# EAGLE design BSAT - Control Shield (EAGLE 6.5.0)
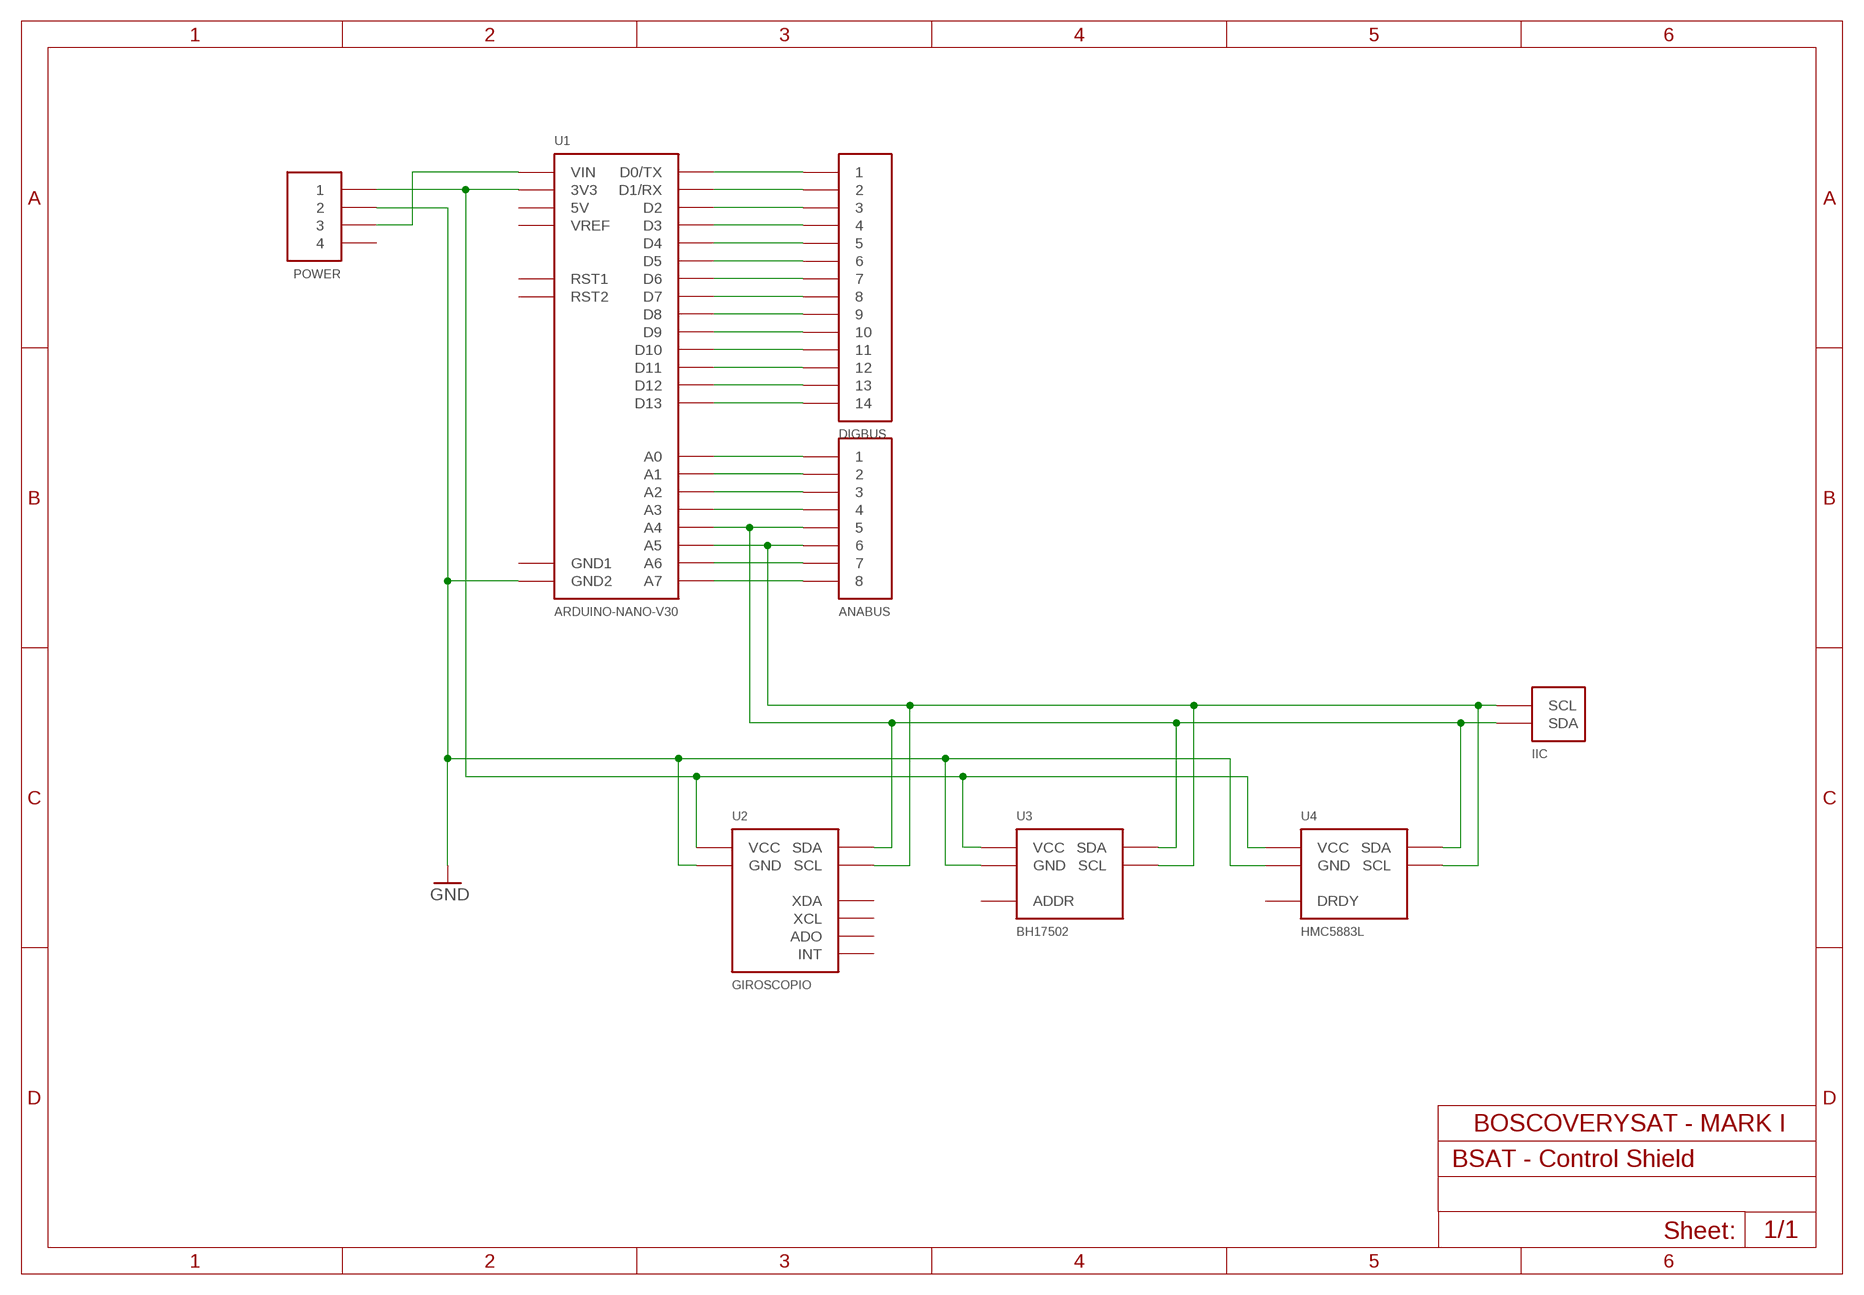
[diagram p0: schematic, sheet 1]

## Parts
ANABUS  8-PIN-DUAL-BUS  [8-PIN-DUAL-BUS]
DIGBUS  14-PIN-DUAL-BUS  [14-PIN-DUAL-BUS]
IIC  IIC-DUAL-BUS  [2-PIN-DUAL-BUS]
POWER  4-PIN-DUAL-BUS  [4-PIN-LINEAL-JUMPER]
U1  ARDUINO-NANO-V30  [ARDUINO-NANO-V30]
U2  GIROSCOPIO  [GIROSCOPIO]
U3  BH17502  [BH1750-2]
U4  HMC5883L  [HMC5883L]

## Nets
GND: POWER.2A POWER.2B U1.GND2 U2.GND U3.GND U4.GND
N$5: DIGBUS.1A DIGBUS.1B U1.D0/TX
N$6: DIGBUS.2A DIGBUS.2B U1.D1/RX
N$7: POWER.3A POWER.3B U1.VIN
N$9: POWER.1A POWER.1B U1.3V3 U2.VCC U3.VCC U4.VCC
N$16: ANABUS.8A ANABUS.8B U1.A7
N$17: ANABUS.7A ANABUS.7B U1.A6
N$28: ANABUS.6A ANABUS.6B IIC.2A(SCL) IIC.2B(SCL) U1.A5 U2.SCL U3.SCL U4.SCL
N$29: ANABUS.5A ANABUS.5B IIC.1A(SDA) IIC.1B(SDA) U1.A4 U2.SDA U3.SDA U4.SDA
N$30: ANABUS.4A ANABUS.4B U1.A3
N$31: ANABUS.3A ANABUS.3B U1.A2
N$32: ANABUS.2A ANABUS.2B U1.A1
N$33: ANABUS.1A ANABUS.1B U1.A0
N$34: DIGBUS.3A DIGBUS.3B U1.D2
N$35: DIGBUS.4A DIGBUS.4B U1.D3
N$36: DIGBUS.5A DIGBUS.5B U1.D4
N$37: DIGBUS.6A DIGBUS.6B U1.D5
N$38: DIGBUS.7A DIGBUS.7B U1.D6
N$39: DIGBUS.8A DIGBUS.8B U1.D7
N$40: DIGBUS.9A DIGBUS.9B U1.D8
N$41: DIGBUS.10A DIGBUS.10B U1.D9
N$42: DIGBUS.11A DIGBUS.11B U1.D10
N$43: DIGBUS.12A DIGBUS.12B U1.D11
N$44: DIGBUS.13A DIGBUS.13B U1.D12
N$45: DIGBUS.14A DIGBUS.14B U1.D13
Unconnected: POWER.4A POWER.4B U1.RST1 U1.RST2 U2.ADO U2.INT U2.XCL U2.XDA U3.ADDR U4.DRDY

## Power pins joined to a net without a drawn wire
5V: U1.5V
GND1: U1.GND1
VREF: U1.VREF

## Library data of the parts
ANABUS = boscoverysat:8-PIN-DUAL-BUS
DIGBUS = boscoverysat:14-PIN-DUAL-BUS
IIC = boscoverysat:IIC-DUAL-BUS
POWER = boscoverysat:4-PIN-DUAL-BUS
U1 = boscoverysat:ARDUINO-NANO-V30
U2 = boscoverysat:GIROSCOPIO
U3 = boscoverysat:BH1750
U4 = boscoverysat:HMC5883L

## Board
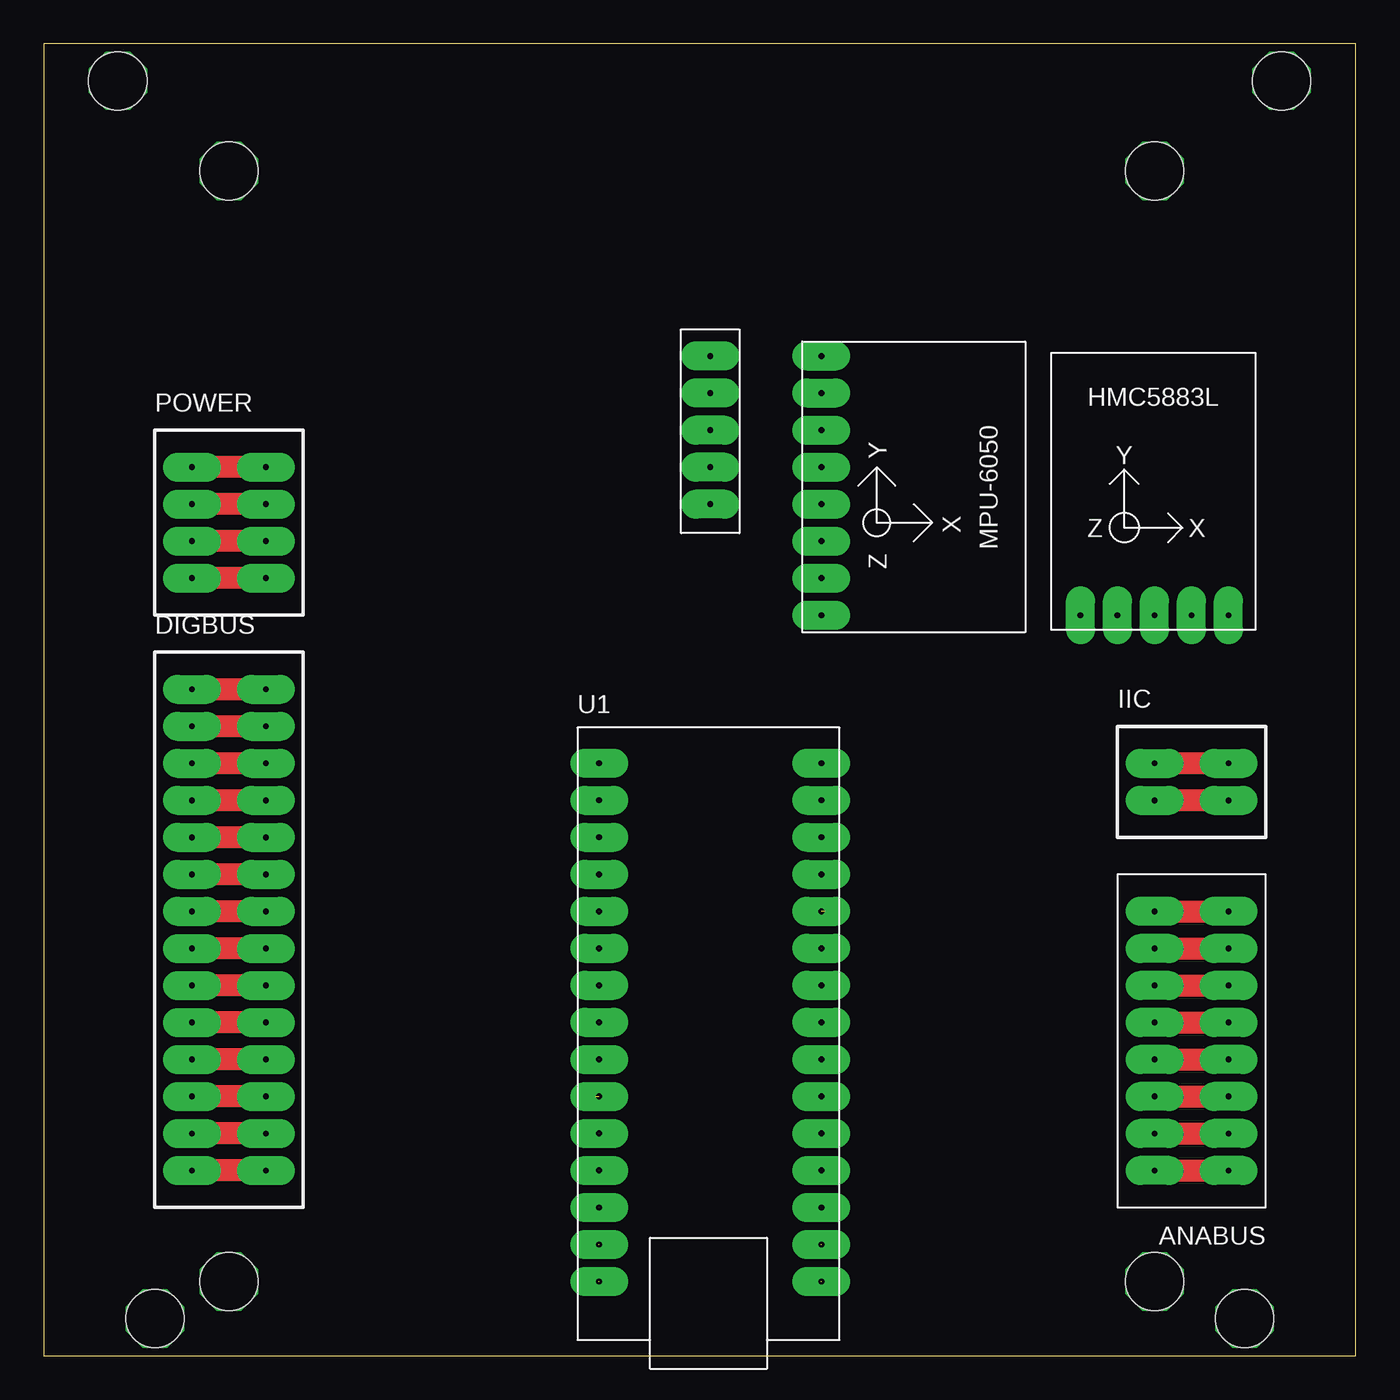
[diagram p1: board, top side]
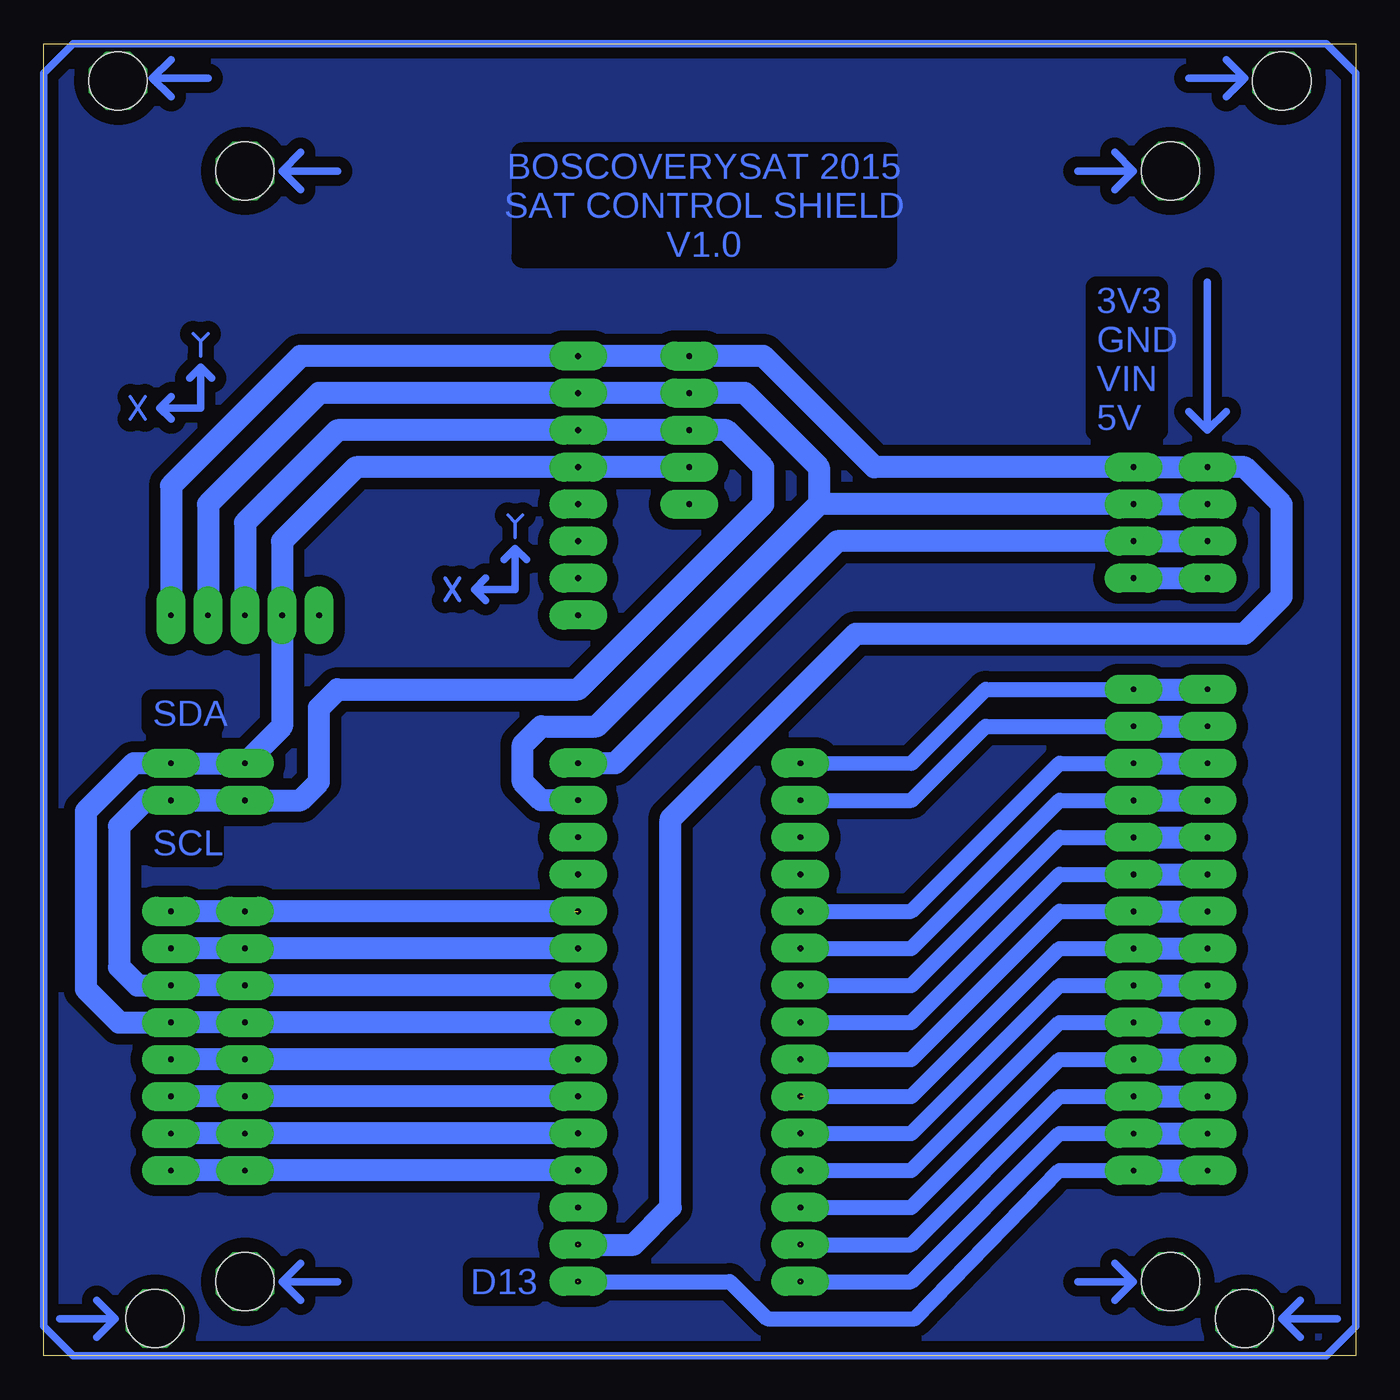
[diagram p2: board, bottom side, seen from below]

Size 90 x 90 mm. Coordinates in mm from the lower left corner, seen from the top.
Outline: 0,0 90,0 90,90 0,90 0,0
Copper layers (1*16): Top 0.035mm / dielectric 1.5mm / Bottom 0.035mm
Design rules "default *": minimum track width 10mil, minimum drill 24mil, track to track 30mil, track to pad 30mil, pad to pad 30mil, via to via 30mil, smd to smd 8mil, copper to edge 40mil, drill to drill 8mil, minimum pad ring 10mil, minimum via ring 8mil, stop-mask expansion 4mil, vias tented up to drill 0mil, thermal gap 10mil
Holes 4 mm at 12.7,5.08 76.2,5.08 12.7,81.28 76.2,81.28 7.62,2.54 5.07,87.46 82.38,2.54 84.91,87.46

### Footprints (pad centres in the part's own frame; a part is rotated, then mirrored left to right if it is on the bottom)
8-PIN-DUAL-BUS = drill 0.4 pad 2 long: 1A 0,17.78; 1B 5.08,17.78; 2A 0,15.24; 2B 5.08,15.24; 3A 0,12.7; 3B 5.08,12.7; 4A 0,10.16; 4B 5.08,10.16; 5A 0,7.62; 5B 5.08,7.62; 6A 0,5.08; 6B 5.08,5.08; 7A 0,2.54; 7B 5.08,2.54; 8A 0,0; 8B 5.08,0
14-PIN-DUAL-BUS = drill 0.4 pad 2 long: 1A 0,33.02; 1B 5.08,33.02; 2A 0,30.48; 2B 5.08,30.48; 3A 0,27.94; 3B 5.08,27.94; 4A 0,25.4; 4B 5.08,25.4; 5A 0,22.86; 5B 5.08,22.86; 6A 0,20.32; 6B 5.08,20.32; 7A 0,17.78; 7B 5.08,17.78; 8A 0,15.24; 8B 5.08,15.24; 9A 0,12.7; 9B 5.08,12.7; 10A 0,10.16; 10B 5.08,10.16; 11A 0,7.62; 11B 5.08,7.62; 12A 0,5.08; 12B 5.08,5.08; 13A 0,2.54; 13B 5.08,2.54; 14A 0,0; 14B 5.08,0
2-PIN-DUAL-BUS = drill 0.4 pad 2 long: 1A 2.54,5.08; 1B 7.62,5.08; 2A 2.54,2.54; 2B 7.62,2.54
4-PIN-LINEAL-JUMPER = drill 0.4 pad 2 long: 1A 0,7.62; 1B 5.08,7.62; 2A 0,5.08; 2B 5.08,5.08; 3A 0,2.54; 3B 5.08,2.54; 4A 0,0; 4B 5.08,0
ARDUINO-NANO-V30 = drill 0.4 pad 2 long: 3V3 15.241,2.546; 5V 15.241,27.946; A0 15.241,7.626; A1 15.241,10.166; A2 15.241,12.706; A3 15.241,15.246; A4 15.241,17.786; A5 15.241,20.326; A6 15.241,22.866; A7 15.241,25.406; D0/TX 0.001,35.566; D1/RX 0.001,33.026; D2 0.001,25.406; D3 0.001,22.866; D4 0.001,20.326; D5 0.001,17.786; D6 0.001,15.246; D7 0.001,12.706; D8 0.001,10.166; D9 0.001,7.626; D10 0.001,5.086; D11 0.001,2.546; D12 0.001,0.006; D13 15.241,0.006; GND1 0.001,27.946; GND2 15.241,33.026; RST1 0.001,30.486; RST2 15.241,30.486; VIN 15.241,35.566; VREF 15.241,5.086
GIROSCOPIO = drill 0.4 pad 2 long: ADO 15.24,0; GND 2.54,0; INT 17.78,0; SCL 5.08,0; SDA 7.62,0; VCC 0,0; XCL 12.7,0; XDA 10.16,0
BH1750-2 = drill 0.4 pad 2 long: ADDR 0,0; GND 7.62,0; SCL 5.08,0; SDA 2.54,0; VCC 10.16,0
HMC5883L = drill 0.4 pad 2 long: DRDY 0,0; GND 7.62,0; SCL 5.08,0; SDA 2.54,0; VCC 10.16,0

### Placement (x,y rotation side)
ANABUS  81.28,30.48 180 top
DIGBUS  10.16,12.7 0 top
IIC  73.66,35.56 0 top
POWER  10.16,53.34 0 top
U1  38.1,5.08 0 top
U2  53.34,68.58 270 top
U3  45.72,58.42 90 top
U4  71.12,50.8 0 top

### Tracks (layer width: path | path; a pad name or v marks a point on that pad's centre or on a via)
GND
  Bottom 1.524: U4.GND 78.74,58.42 71.12,66.04 U2.GND U3.GND 41.91,66.04 36.83,60.96 36.83,58.42 | POWER.2B 36.83,58.42 | U1.GND2 55.89,38.11 57.15,39.37 57.15,41.91 55.88,43.18 52.07,43.18 36.83,58.42
N$1  (via drill 0.4 pad 4)
  other vias: 84.92,87.47
N$5
  Bottom 1.016: U1.D0/TX 30.48,40.64 25.4,45.72 DIGBUS.1B
N$6
  Bottom 1.016: U1.D1/RX 30.48,38.1 25.4,43.18 DIGBUS.2B
N$7
  Bottom 1.524: POWER.3B 35.56,55.88 50.8,40.64 U1.VIN
N$9  (1 unrouted)
  Bottom 1.524: U1.3V3 49.53,7.62 46.99,10.16 46.99,36.83 34.29,49.53 7.62,49.53 5.08,52.07 5.08,58.42 7.62,60.96 POWER.1A | U4.VCC 81.28,59.69 72.39,68.58 U2.VCC U3.VCC 40.64,68.58 33.02,60.96 POWER.1B
N$10
  Bottom 0.508: 57.66,55.37 57.66,52.58 60.45,52.58 | 57.66,55.37 58.42,54.61 | 57.66,55.37 56.9,54.61 | 60.45,52.58 59.69,53.34 | 60.45,52.58 59.69,51.82
N$11
  Bottom 0.254: 61.47,53.34 62.48,51.82
N$12
  Bottom 0.254: 62.48,53.34 61.47,51.82
N$13
  Bottom 0.254: 57.15,57.66 57.66,57.15 | 57.66,57.15 58.17,57.66 | 57.66,57.15 57.66,56.13
N$16  (1 unrouted)
  Bottom 1.524: 53.59,30.48 ANABUS.8B
N$17  (1 unrouted)
  Bottom 1.524: U1.A6 ANABUS.7B
N$18
  Bottom 0.508: 79.25,67.82 79.25,65.02 82.04,65.02 | 79.25,67.82 80.01,67.06 | 79.25,67.82 78.49,67.06 | 82.04,65.02 81.28,65.79 | 82.04,65.02 81.28,64.26
N$19
  Bottom 0.254: 83.06,65.79 84.07,64.26
N$20
  Bottom 0.254: 84.07,65.79 83.06,64.26
N$21
  Bottom 0.254: 78.74,70.1 79.25,69.6 | 79.25,69.6 79.76,70.1 | 79.25,69.6 79.25,68.58
N$22
  Bottom 0.508: 10.16,73.66 10.16,63.5 | 10.16,63.5 11.43,64.77 | 10.16,63.5 8.89,64.77
N$23  (via drill 0.4 pad 4)
  other vias: 5.08,87.47
N$24  (via drill 0.4 pad 4)
  other vias: 12.7,81.28
N$25  (via drill 0.4 pad 4)
  other vias: 76.2,81.28
N$27  (via drill 0.4 pad 4)
  other vias: 7.62,2.54
N$28
  Bottom 1.524: U1.A5 ANABUS.6B | ANABUS.6A 83.57,25.4 84.84,26.67 84.84,36.32 83.06,38.1 IIC.2A 72.39,38.1 71.12,39.37 71.12,44.45 69.85,45.72 53.34,45.72 40.64,58.42 40.64,60.96 43.18,63.5 U3.SCL U2.SCL 69.85,63.5 76.2,57.15 U4.SCL
N$29
  Bottom 1.524: U1.A4 ANABUS.5B | IIC.1B 83.82,40.64 87.12,37.34 87.12,25.15 84.84,22.86 ANABUS.5A | U3.SDA U2.SDA 68.58,60.96 73.66,55.88 U4.SDA 73.66,43.18 IIC.1A
N$30
  Bottom 1.524: U1.A3 ANABUS.4B
N$31
  Bottom 1.524: U1.A2 ANABUS.3B
N$32
  Bottom 1.524: U1.A1 ANABUS.2B
N$33
  Bottom 1.524: U1.A0 ANABUS.1B
N$34  (1 unrouted)
  Bottom 1.016: U1.D2 30.48,30.48 20.32,40.64 DIGBUS.3B
N$35  (1 unrouted)
  Bottom 1.016: U1.D3 30.48,27.94 20.32,38.1 DIGBUS.4B
N$36  (1 unrouted)
  Bottom 1.016: U1.D4 30.48,25.4 20.32,35.56 DIGBUS.5B
N$37  (1 unrouted)
  Bottom 1.016: U1.D5 30.48,22.86 20.32,33.02 DIGBUS.6B
N$38  (1 unrouted)
  Bottom 1.016: U1.D6 30.48,20.32 20.32,30.48 DIGBUS.7B
N$39  (1 unrouted)
  Bottom 1.016: 37.85,17.78 30.48,17.78 20.32,27.94 DIGBUS.8B
N$40  (1 unrouted)
  Bottom 1.016: U1.D8 30.48,15.24 20.32,25.4 DIGBUS.9B
N$41  (1 unrouted)
  Bottom 1.016: U1.D9 30.48,12.7 20.32,22.86 DIGBUS.10B
N$42  (1 unrouted)
  Bottom 1.016: U1.D10 30.48,10.16 20.32,20.32 DIGBUS.11B
N$43  (1 unrouted)
  Bottom 1.016: U1.D11 30.48,7.62 20.32,17.78 DIGBUS.12B
N$44  (1 unrouted)
  Bottom 1.016: U1.D12 30.48,5.08 20.32,15.24 DIGBUS.13B
N$45  (1 unrouted)
  Bottom 1.016: U1.D13 42.93,5.08 40.39,2.54 30.23,2.54 20.32,12.7 DIGBUS.14B
N$46  (via drill 0.4 pad 4)
  other vias: 12.7,5.08
N$47  (via drill 0.4 pad 4)
  other vias: 76.2,5.08
N$48  (via drill 0.4 pad 4)
  other vias: 82.38,2.54
N$49
  Bottom 0.508: 69.85,81.28 73.66,81.28 | 73.66,81.28 72.39,82.55 | 73.66,81.28 72.39,80.01
N$50
  Bottom 0.508: 78.74,87.63 82.55,87.63 | 82.55,87.63 81.28,88.9 | 82.55,87.63 81.28,86.36
N$51
  Bottom 0.508: 19.05,81.28 15.24,81.28 | 15.24,81.28 16.51,80.01 | 15.24,81.28 16.51,82.55
N$52
  Bottom 0.508: 11.43,87.63 7.62,87.63 | 7.62,87.63 8.89,86.36 | 7.62,87.63 8.89,88.9
N$53
  Bottom 0.508: 1.27,2.54 5.08,2.54 | 5.08,2.54 3.81,3.81 | 5.08,2.54 3.81,1.27
N$54
  Bottom 0.508: 19.05,5.08 15.24,5.08 | 15.24,5.08 16.51,3.81 | 15.24,5.08 16.51,6.35
N$55
  Bottom 0.508: 69.85,5.08 73.66,5.08 | 73.66,5.08 72.39,6.35 | 73.66,5.08 72.39,3.81
N$56
  Bottom 0.508: 88.9,2.54 85.09,2.54 | 85.09,2.54 86.36,1.27 | 85.09,2.54 86.36,3.81
N$57
  Bottom 0.508: 2,90 0,88 0,2 2,0 88,0 90,2 90,88 88,90 2,90
N$58
  pour Bottom: 2,90 0,88 0,2 2,0 88,0 90,2 90,88 88,90

### Text on the board
Bottom: BOSCOVERYSAT 2015 / SAT CONTROL SHIELD / V1.0 | 3V3 / GND / VIN / 5V | SDA | SCL | D13